# EAGLE schematic schematic (EAGLE 5.11)
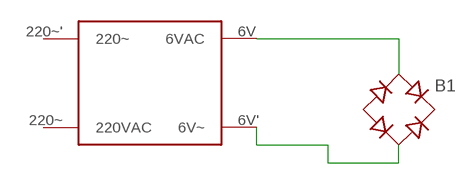
[diagram p0: schematic, sheet 1]

## Parts
B1  B-DIL  [B-DIL]
U$1  TR220-6V/220MA  [TRAF6V220MA]

## Nets
N$1: B1.AC1 U$1.6V(6VAC)
N$2: B1.AC2 U$1.6V'(6V~)
Unconnected: B1.+ B1.- U$1.220~'(220~) U$1.220~(220VAC)

## Library data of the parts
B1 = rectifier:B-DIL: RECTIFIER
U$1 = ANG1.3VA_6V(komet):TR220-6V/220MA